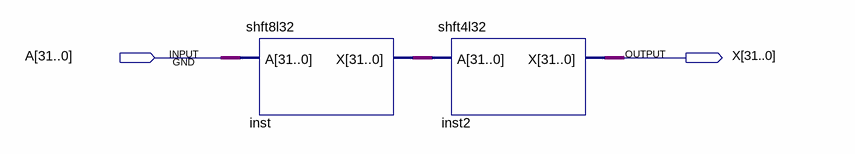
[diagram p0: schematic sheet]
// Quartus schematic shft12l32.bdf as structural Verilog: 2 symbols, 2 pins
module shft12l32 (
  input  [31:0] A,
  output [31:0] X
);

  wire [31:0] inst_x;

  shft8l32 inst (.A(A), .X(inst_x));
  shft4l32 inst2 (.A(inst_x), .X(X));
endmodule
